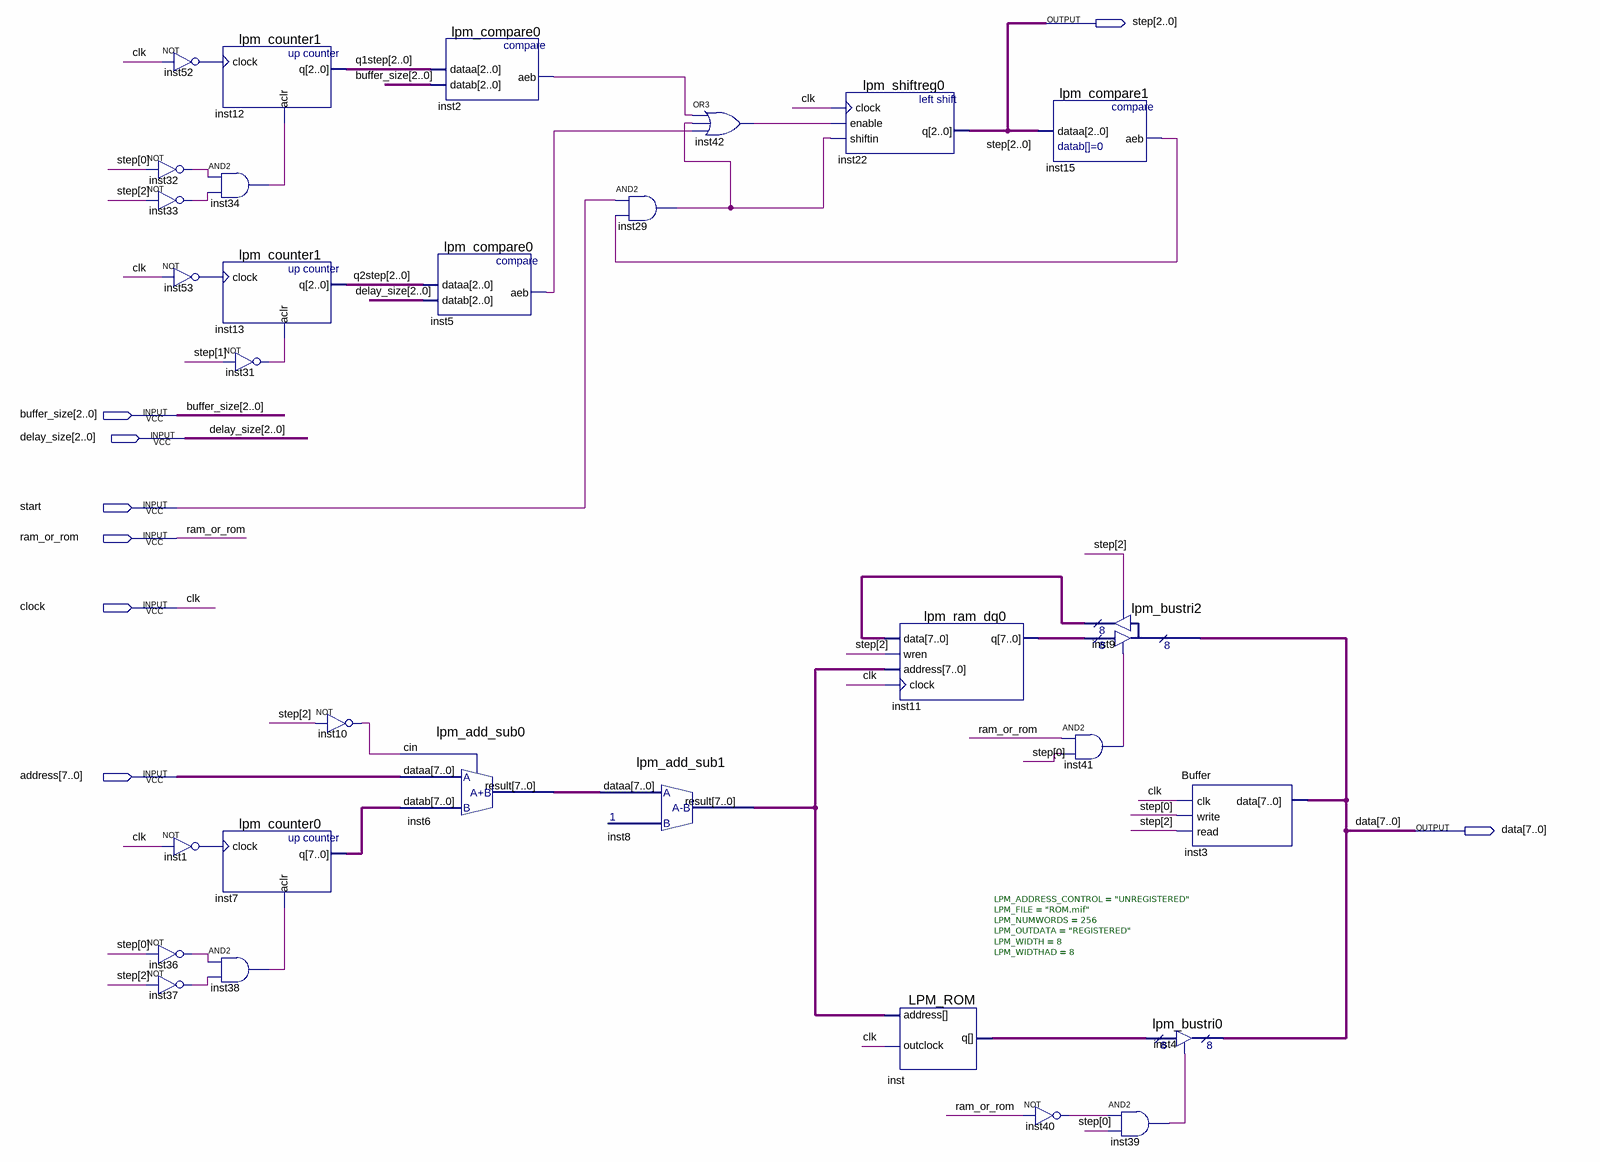
[diagram p0: schematic sheet]
// Quartus schematic LAB3.bdf as structural Verilog: 30 symbols, 8 pins
module LAB3 (
  input  [2:0] buffer_size,
  input  [2:0] delay_size,
  input  start,
  input  ram_or_rom,
  input  clock,
  input  [7:0] address,
  output [2:0] step,
  output [7:0] data
);

  wire inst1_out, inst2_aeb, inst5_aeb, inst10_out, inst15_aeb, inst29_out, inst31_out, inst32_out,
       inst33_out, inst34_out, inst36_out, inst37_out, inst38_out, inst39_out, inst40_out, inst41_out,
       inst42_out, inst52_out, inst53_out;
  wire [2:0] q1step, q2step;
  wire [7:0] inst6_result, inst7_q, inst8_result, inst9_result, inst11_q, inst_q;

  not inst52 (inst52_out, clock);
  not inst32 (inst32_out, step[0]);
  not inst33 (inst33_out, step[2]);
  not inst53 (inst53_out, clock);
  not inst1 (inst1_out, clock);
  not inst36 (inst36_out, step[0]);
  not inst37 (inst37_out, step[2]);
  lpm_counter1 inst12 (.clock(inst52_out), .aclr(inst34_out), .q(q1step));
  and inst34 (inst34_out, inst32_out, inst33_out);
  lpm_counter1 inst13 (.clock(inst53_out), .aclr(inst31_out), .q(q2step));
  not inst31 (inst31_out, step[1]);
  lpm_counter0 inst7 (.clock(inst1_out), .aclr(inst38_out), .q(inst7_q));
  and inst38 (inst38_out, inst36_out, inst37_out);
  not inst10 (inst10_out, step[2]);
  lpm_add_sub0 inst6 (.dataa(address), .datab(inst7_q), .cin(inst10_out), .result(inst6_result));
  lpm_compare0 inst2 (.dataa(q1step), .datab(buffer_size), .aeb(inst2_aeb));
  lpm_compare0 inst5 (.dataa(q2step), .datab(delay_size), .aeb(inst5_aeb));
  lpm_add_sub1 inst8 (.dataa(inst6_result), .result(inst8_result));
  and inst29 (inst29_out, start, inst15_aeb);
  or inst42 (inst42_out, inst2_aeb, inst29_out, inst5_aeb);
  lpm_shiftreg0 inst22 (.clock(clock), .enable(inst42_out), .shiftin(inst29_out), .q(step));
  lpm_ram_dq0 inst11 (.data(inst9_result), .wren(step[2]), .address(inst8_result), .clock(clock), .q(inst11_q));
  LPM_ROM #(.LPM_ADDRESS_CONTROL("UNREGISTERED"), .LPM_FILE("ROM.mif"), .LPM_NUMWORDS(256), .LPM_OUTDATA("REGISTERED"), .LPM_WIDTH(8), .LPM_WIDTHAD(8)) inst (
    .address(inst8_result), .outclock(clock), .q(inst_q));
  not inst40 (inst40_out, ram_or_rom);
  lpm_compare1 inst15 (.dataa(step), .aeb(inst15_aeb));
  lpm_bustri2 inst9 (.enabledt(inst41_out), .data(inst11_q), .enabletr(step[2]), .result(inst9_result), .tridata(data));
  and inst41 (inst41_out, ram_or_rom, step[0]);
  lpm_bustri0 inst4 (.enabledt(inst39_out), .data(inst_q), .tridata(data));
  and inst39 (inst39_out, inst40_out, step[0]);
  Buffer inst3 (.clk(clock), .write(step[0]), .read(step[2]), .data(data));

  // Other names for the same wires on the sheet: clk = clock
endmodule
